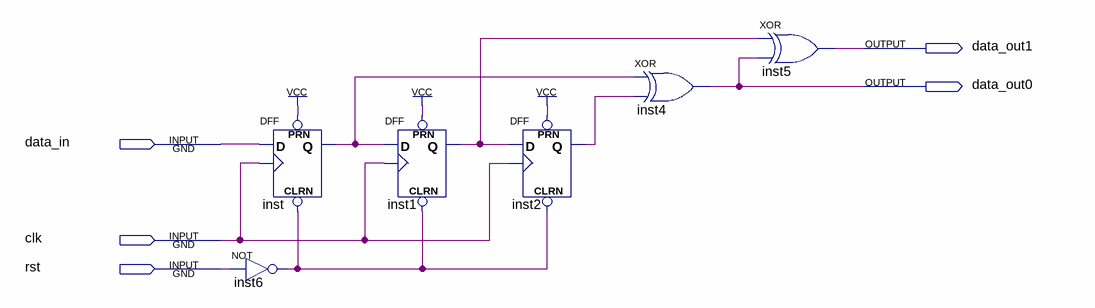
[diagram p0: schematic sheet]
// Quartus schematic convolutional_code_sr.bdf as structural Verilog: 6 symbols, 5 pins
module convolutional_code_sr (
  input  data_in,
  input  clk,
  input  rst,
  output data_out1,
  output data_out0
);

  wire inst1_q, inst2_q, inst6_out, inst_q;

  DFF inst (.CLRN(inst6_out), .CLK(clk), .D(data_in), .PRN(1'b1), .Q(inst_q));
  not inst6 (inst6_out, rst);
  DFF inst1 (.CLRN(inst6_out), .CLK(clk), .D(inst_q), .PRN(1'b1), .Q(inst1_q));
  DFF inst2 (.CLRN(inst6_out), .CLK(clk), .D(inst1_q), .PRN(1'b1), .Q(inst2_q));
  xor inst4 (data_out0, inst_q, inst2_q);
  xor inst5 (data_out1, inst1_q, data_out0);
endmodule
